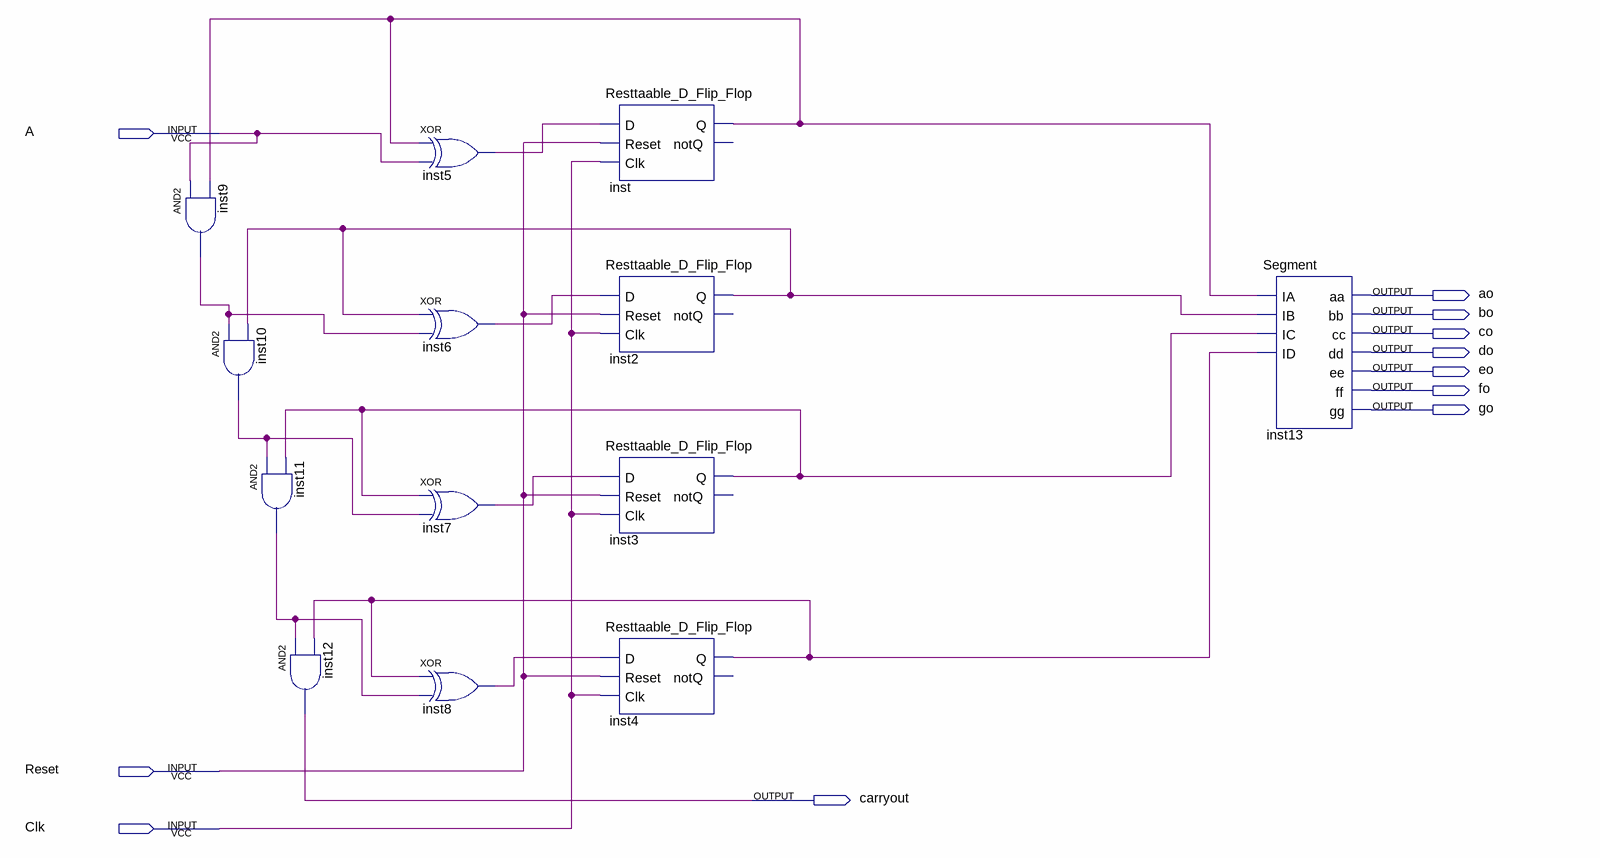
[diagram p0: schematic sheet]
// Quartus schematic Counter.bdf as structural Verilog: 13 symbols, 11 pins
module Counter (
  input  A,
  input  Reset,
  input  Clk,
  output ao,
  output bo,
  output co,
  output \do ,
  output eo,
  output fo,
  output go,
  output carryout
);

  wire inst2_q, inst3_q, inst4_q, inst5_out, inst6_out, inst7_out, inst8_out, inst9_out, inst10_out,
       inst11_out, inst_q;

  and inst9 (inst9_out, A, inst_q);
  and inst10 (inst10_out, inst9_out, inst2_q);
  and inst11 (inst11_out, inst10_out, inst3_q);
  and inst12 (carryout, inst11_out, inst4_q);
  xor inst5 (inst5_out, inst_q, A);
  xor inst6 (inst6_out, inst2_q, inst9_out);
  xor inst7 (inst7_out, inst3_q, inst10_out);
  xor inst8 (inst8_out, inst4_q, inst11_out);
  Resttaable_D_Flip_Flop inst (.D(inst5_out), .Reset(Reset), .Clk(Clk), .Q(inst_q));  // open: notQ
  Resttaable_D_Flip_Flop inst2 (.D(inst6_out), .Reset(Reset), .Clk(Clk), .Q(inst2_q));  // open: notQ
  Resttaable_D_Flip_Flop inst3 (.D(inst7_out), .Reset(Reset), .Clk(Clk), .Q(inst3_q));  // open: notQ
  Resttaable_D_Flip_Flop inst4 (.D(inst8_out), .Reset(Reset), .Clk(Clk), .Q(inst4_q));  // open: notQ
  Segment inst13 (
    .IA(inst_q), .IB(inst2_q), .IC(inst3_q), .ID(inst4_q), .aa(ao), .bb(bo), .cc(co), .dd(\do ), .ee(eo),
    .ff(fo), .gg(go));
endmodule
